# EAGLE design UVBox-I2C_LCD (EAGLE 8.6.0)
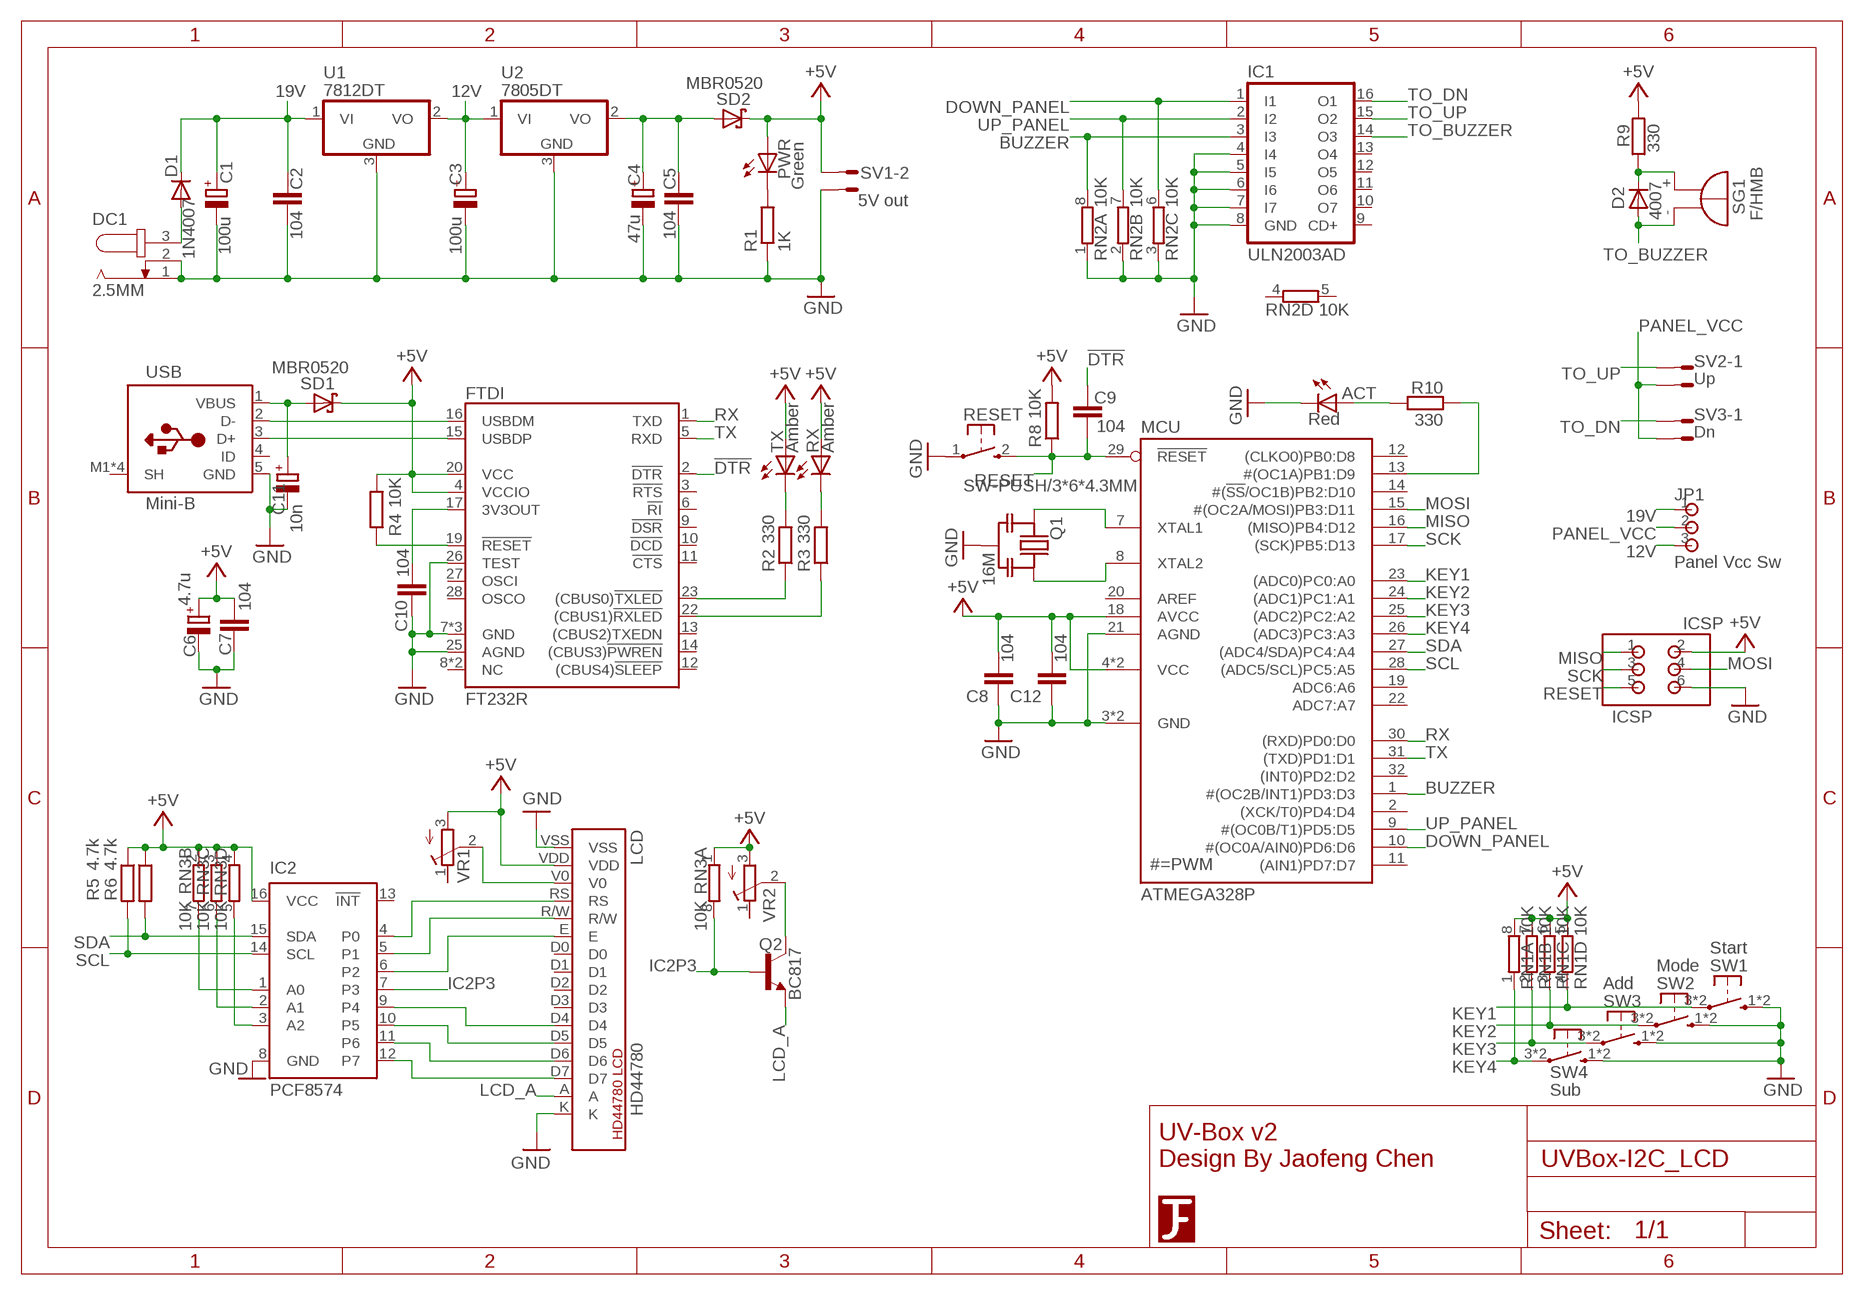
[diagram p0: schematic, sheet 1]

## Parts
ACT  Red  LEDCHIPLED_0805  [CHIPLED_0805]
C1  100u  CPOL-EU140CLH-0810  [140CLH-0810]
C2  104  C-EUC0805  [C0805]
C3  100u  CPOL-EUSMCC  [SMC_C]
C4  47u  CPOL-EUSMCC  [SMC_C]
C5  104  C-EUC0805  [C0805]
C6  4.7u  CPOL-EUSMCB  [SMC_B]
C7  104  C-EUC0603  [C0603]
C8  104  C-EUC0603  [C0603]
C9  104  C-EUC0603  [C0603]
C10  104  C-EUC0603  [C0603]
C11  10n  CPOL-EUSMCA  [SMC_A]
C12  104  C-EUC0603  [C0603]
D1  1N4007  DIODE-DO-214AC  [DO-214AC]
D2  4007  DIODE-DO214AA  [DO214AA]
DC1  2.5MM  DC-JACK/2.5MM  [SPC4078]
FTDI  FT232R  [SSOP28]
IC1  ULN2003AD  [SO16(R-PDSO-G16)]
IC2  PCF8574  PCF8574/SO16W  [SO16W]
ICSP  ICSP  PIN-2X3/2.54-DIP  [DIP-2.54-2X3]
JP1  Panel Vcc Sw  PIN-1X3-2.54  [DIP-2.54-1X3]
LCD  HD44780  LCD-HD44780-1602  [LCD_1602]
MCU  ATMEGA328P  ATMEGA328P-TQFP32  [TQFP32]
PWR  Green  LEDCHIPLED_0805  [CHIPLED_0805]
Q1  16M  CERMOSCILL-CSTCE  [CSTCE]
Q2  BC817  BC817-16SMD  [SOT23-BEC]
R1  1K  R-EU_R0603  [R0603]
R2  330  R-EU_R0603  [R0603]
R3  330  R-EU_R0603  [R0603]
R4  10K  R-EU_R0603  [R0603]
R5  4.7k  R-EU_R0603  [R0603]
R6  4.7k  R-EU_R0603  [R0603]
R8  10K  R-EU_R0603  [R0603]
R9  330  R-EU_R0603  [R0603]
R10  330  R-EU_R0603  [R0603]
RESET  SW-PUSH/3*6*4.3MM  [SW-3*6*4.3MM]
RN1  10K  RN4R-CAY16  [CAY16]
RN2  10K  RN4R-CAY16  [CAY16]
RN3  10K  RN4R-CAY16  [CAY16]
RX  Amber  LEDCHIPLED_0805  [CHIPLED_0805]
SD1  MBR0520  SCHOTTKY  [SOD123]
SD2  MBR0520  SCHOTTKY  [SOD123]
SG1  F/HMB  [F/HMB]
SV1  5V out  L02P  [L02P]
SV2  Up  L02P  [L02P]
SV3  Dn  L02P  [L02P]
SW1  Start  SW-PUSH/6*6*3.8MM  [SW-6*6*3.8MM]
SW2  Mode  SW-PUSH/6*6*3.8MM  [SW-6*6*3.8MM]
SW3  Add  SW-PUSH/6*6*3.8MM  [SW-6*6*3.8MM]
SW4  Sub  SW-PUSH/6*6*3.8MM  [SW-6*6*3.8MM]
TX  Amber  LEDCHIPLED_0805  [CHIPLED_0805]
U1  7812DT  [TO252]
U2  7805DT  [TO252]
U$2  LOGO-3B  [LOGO-3-B]
USB  Mini-B  USB-MINI-B/NO_HOLE  [USB-MINI-B(NO_HOLE)]
VR1  R-TRIMMT93XA  [RTRIMT93XA]
VR2  R-TRIMMT93XA  [RTRIMT93XA]

## Nets
12V: C3.+ JP1.3 U1.2(VO) U2.1(VI)
19V: C1.+ C2.1 D1.C JP1.1 U1.1(VI)
!DTR: C9.2 FTDI.2(!DTR)
!RESET: FTDI.19(!RESET) R4.1
!RXLED: FTDI.22((CBUS1)!RXLED) R3.1
!TXLED: FTDI.23((CBUS0)!TXLED) R2.1
+5V: C6.+ C7.1 C8.2 C12.2 FTDI.4(VCCIO) FTDI.20(VCC) IC2.16(VCC) ICSP.2 LCD.VDD MCU.4(VCC) MCU.6(VCC) MCU.18(AVCC) PWR.A R4.2 R5.1 R6.1 R8.2 R9.2 RN1.5 RN1.6 RN1.7 RN1.8 RN3.1 RN3.2 RN3.3 RN3.4 RX.A SD1.K SD2.K SV1.2 TX.A VR1.3(A) VR2.3(A)
A0: IC2.1(A0) RN3.7
A1: IC2.2(A1) RN3.6
A2: IC2.3(A2) RN3.5
ACT_LED: ACT.A R10.2
BUZZER: IC1.3(I3) MCU.1(#(OC2B/INT1)PD3:D3) RN2.8
D+: FTDI.15(USBDP) USB.3(D+)
D-: FTDI.16(USBDM) USB.2(D-)
DOWN_PANEL: IC1.1(I1) MCU.10(#(OC0A/AIN0)PD6:D6) RN2.6
E: IC2.6(P2) LCD.E
GND: ACT.C C1.- C2.2 C3.- C4.- C5.2 C6.- C7.2 C8.1 C10.1 C11.- C12.1 DC1.1 DC1.2 FTDI.7(GND) FTDI.18(GND) FTDI.21(GND) FTDI.25(AGND) FTDI.26(TEST) IC1.4(I4) IC1.5(I5) IC1.6(I6) IC1.7(I7) IC1.8(GND) IC2.8(GND) ICSP.6 LCD.K LCD.VSS MCU.3(GND) MCU.5(GND) MCU.21(AGND) Q1.2(GND) R1.1 RESET.1(P) RN2.1 RN2.2 RN2.3 SV1.1 SW1.1(S) SW1.2(S) SW2.1(S) SW2.2(S) SW3.1(S) SW3.2(S) SW4.1(S) SW4.2(S) U1.3(GND) U2.3(GND) USB.5(GND)
IC2P3: IC2.7(P3) Q2.B RN3.8
KEY1: MCU.23((ADC0)PC0:A0) RN1.4 SW1.3(P) SW1.4(P)
KEY2: MCU.24((ADC1)PC1:A1) RN1.3 SW2.3(P) SW2.4(P)
KEY3: MCU.25((ADC2)PC2:A2) RN1.2 SW3.3(P) SW3.4(P)
KEY4: MCU.26((ADC3)PC3:A3) RN1.1 SW4.3(P) SW4.4(P)
LCD_A: LCD.A Q2.E
MISO: ICSP.1 MCU.16((MISO)PB4:D12)
MOSI: ICSP.4 MCU.15(#(OC2A/MOSI)PB3:D11)
N$2: C11.+ SD1.A USB.1(VBUS)
N$3: C4.+ C5.1 SD2.A U2.2(VO)
N$4: D1.A DC1.3
N$10: PWR.C R1.2
N$12: Q2.C VR2.2(S)
N$16: R2.2 TX.C
N$17: R3.2 RX.C
N$18: D2.C R9.1 SG1.+
N$25: IC2.12(P7) LCD.D7
N$26: IC2.11(P6) LCD.D6
N$27: IC2.10(P5) LCD.D5
N$28: IC2.9(P4) LCD.D4
N$31: C10.2 FTDI.17(3V3OUT)
PANEL_VCC: JP1.2 SV2.2 SV3.2
PB1: MCU.13(#(OC1A)PB1:D9) R10.1
R/W: IC2.5(P1) LCD.R/W
RESET: C9.1 ICSP.5 MCU.29(!RESET) R8.1 RESET.2(S)
RS: IC2.4(P0) LCD.RS
RX: FTDI.1(TXD) MCU.30((RXD)PD0:D0)
SCK: ICSP.3 MCU.17((SCK)PB5:D13)
SCL: IC2.14(SCL) MCU.28((ADC5/SCL)PC5:A5) R5.2
SDA: IC2.15(SDA) MCU.27((ADC4/SDA)PC4:A4) R6.2
TO_BUZZER: D2.A IC1.14(O3) SG1.-
TO_DN: IC1.16(O1) SV3.1
TO_UP: IC1.15(O2) SV2.1
TX: FTDI.5(RXD) MCU.31((TXD)PD1:D1)
UP_PANEL: IC1.2(I2) MCU.9(#(OC0B/T1)PD5:D5) RN2.7
VD: LCD.V0 VR1.2(S)
XTAL1: MCU.7(XTAL1) Q1.1(IN)
XTAL2: MCU.8(XTAL2) Q1.3(OUT)
Unconnected: FTDI.3(!RTS) FTDI.6(!RI) FTDI.8(NC) FTDI.9(!DSR) FTDI.10(!DCD) FTDI.11(!CTS) FTDI.12((CBUS4)!SLEEP) FTDI.13((CBUS2)TXEDN) FTDI.14((CBUS3)!PWREN) FTDI.24(NC) FTDI.27(OSCI) FTDI.28(OSCO) IC1.9(CD+) IC1.10(O7) IC1.11(O6) IC1.12(O5) IC1.13(O4) IC2.13(!INT) LCD.D0 LCD.D1 LCD.D2 LCD.D3 LCD.P$1 LCD.P$2 LCD.P$3 LCD.P$4 MCU.2((XCK/T0)PD4:D4) MCU.11((AIN1)PD7:D7) MCU.12((CLKO0)PB0:D8) MCU.14(#(!SS!/OC1B)PB2:D10) MCU.19(ADC6:A6) MCU.20(AREF) MCU.22(ADC7:A7) MCU.32((INT0)PD2:D2) RN2.4 RN2.5 USB.4(ID) USB.M1(SH) USB.M2(SH) USB.M3(SH) USB.M4(SH) VR1.1(E) VR2.1(E)

## Notes on the sheet
- UV-Box v2
  Design By Jaofeng Chen

## Library data of the parts
ACT PWR RX TX = led:LED: LED OSRAM: - CHIPLED LG R971, LG N971, LY N971, LG Q971, LY Q971, LO R971, LY R971 LH N974, LH R974 LS Q976, LO Q976, LY Q976 LO Q996 - Hyper CHIPLED LW Q18S LB Q993, LB Q99A, LB R99A - SideLED LS A670, LO A670, LY A670, LG A670, LP A670 LB A673, LV A673, LT A673, LW A673 LH A674 LY A675 LS A676, LA A676, LO A676, LY A676, LW A676 LS A679, LY A679, LG A679 - Hyper Micro SIDELED® LS Y876, LA Y876, LO Y876, LY Y876 LT Y87S - SmartLED LW L88C, LW L88S LB L89C, LB L89S, LG L890 LS L89K, LO L89K, LY L89K LS L896, LA L896, LO L896, LY L896 - TOPLED LS T670, LO T670, LY T670, LG T670, LP T670 LSG T670, LSP T670, LSY T670, LOP T670, LYG T670 LG T671, LOG T671, LSG T671 LB T673, LV T673, LT T673, LW T673 LH T674 LS T676, LA T676, LO T676, LY T676, LB T676, LH T676, LSB T676, LW T676 LB T67C, LV T67C, LT T67C, LS T67K, LO T67K, LY T67K, LW E67C LS E67B, LA E67B, LO E67B, LY E67B, LB E67C, LV E67C, LT E67C LW T67C LS T679, LY T679, LG T679 LS T770, LO T770, LY T770, LG T770, LP T770 LB T773, LV T773, LT T773, LW T773 LH T774 LS E675, LA E675, LY E675, LS T675 LS T776, LA T776, LO T776, LY T776, LB T776 LHGB T686 LT T68C, LB T68C - Hyper Mini TOPLED® LB M676 - Mini TOPLED Santana® LG M470 LS M47K, LO M47K, LY M47K Source: http://www.osram.convergy.de LUXEON: - LUMILED® LXK2-PW12-R00, LXK2-PW12-S00, LXK2-PW14-U00, LXK2-PW14-V00 LXK2-PM12-R00, LXK2-PM12-S00, LXK2-PM14-U00 LXK2-PE12-Q00, LXK2-PE12-R00, LXK2-PE12-S00, LXK2-PE14-T00, LXK2-PE14-U00 LXK2-PB12-K00, LXK2-PB12-L00, LXK2-PB12-M00, LXK2-PB14-N00, LXK2-PB14-P00, LXK2-PB14-Q00 LXK2-PR12-L00, LXK2-PR12-M00, LXK2-PR14-Q00, LXK2-PR14-R00 LXK2-PD12-Q00, LXK2-PD12-R00, LXK2-PD12-S00 LXK2-PH12-R00, LXK2-PH12-S00 LXK2-PL12-P00, LXK2-PL12-Q00, LXK2-PL12-R00 Source: www.luxeon.com KINGBRIGHT: KA-3528ASYC Source: www.kingbright.com
C1 C3 C4 C6 C11 = rcl:CPOL-EU: POLARIZED CAPACITOR, European symbol
C2 C5 C7-C10 C12 = rcl:C-EU: CAPACITOR, European symbol
D1 D2 = diode:DIODE-: DIODE
DC1 = 0_MyCustom:DC-JACK: DC 電源插座 Power Jack, DC, Right Angle, Through Hole, Rated 5A at 16VDC, PC Terminals Distributor: Farnell (www.Farnell.de) Drawing: 84N1161.pdf / 84N1162.pdf Manufacturer: SPC Technology (www.spctechnology.com) Type: SPC4077(2mm) / SPC 4078(2.5mm)
FTDI = 0_MyIC:FT232R: FTDI FT232R
IC1 = 0_MyIC:ULN2003A
IC2 = 0_MyIC:PCF8574: 8-bit I2C I/O expander with interrupt Remote 8-Bit I2C-Bus I/O Expander for with Interrupt output http://www.ti.com/product/PCF8574/description Description This 8-bit input/output (I/O) expander for the two-line bidirectional bus (I2C) is designed for 2.5-V to 6-V VCC operation. The PCF8574 device provides general-purpose remote I/O expansion for most microcontroller families by way of the I2C interface [serial clock (SCL), serial data (SDA)]. The device features an 8-bit quasi-bidirectional I/O port (P0–P7), including latched outputs with high-current drive capability for directly driving LEDs. Each quasi-bidirectional I/O can be used as an input or output without the use of a data-direction control signal. At power on, the I/Os are high. In this mode, only a current source to VCC is active. Features • Low Standby-Current Consumption of 10 µA Max • I2C to Parallel-Port Expander • Open-Drain Interrupt Output • Compatible With Most Microcontrollers • Latched Outputs With High-Current Drive Capability for Directly Driving LEDs • Latch-Up Performance Exceeds 100 mA Per JESD 78, Class II
ICSP = 0_MyCustom:PIN-2X3
JP1 = 0_MyCustom:PIN-1X3; PIN1: 19v; PIN3: 12v
LCD = 0_MyCustom:LCD-HD44780: Hitachi HD44780U 1602 LCD 相容板
MCU = 0_MyIC:ATMEGA*-TQFP32: Atmel® AVR® 8-bit Microcontroller with 4/8/16/32KBytes In- System Programmable Flash Device Flash EEPROM RAM Max Speed Power ATmega8 8KBytes 512Bytes 1KBytes 0~16MHz 4.5V~5.5V ATmega8A 8KBytes 512Bytes 1KBytes 0~16MHz 2.7V~5.5V ATmega8L 8KBytes 512Bytes 1KBytes 0~8MHz 2.7V~5.5V ATmega48A 4KBytes 256Bytes 512Bytes 0~20MHz 1.8V~5.5V ATmega48PA 4KBytes 256Bytes 512Bytes 0~20MHz 1.8V~5.5V ATmega88A 8KBytes 512Bytes 1KBytes 0~20MHz 1.8V~5.5V ATmega88PA 8KBytes 512Bytes 1KBytes 0~20MHz 1.8V~5.5V ATmega168A 16KBytes 512Bytes 1KBytes 0~20MHz 1.8V~5.5V ATmega168PA 16KBytes 512Bytes 1KBytes 0~20MHz 1.8V~5.5V ATmega328 32KBytes 1KBytes 2KBytes 0~20MHz 1.8V~5.5V ATmega328P 32KBytes 1KBytes 2KBytes 0~20MHz 1.8V~5.5V
Q1 = 0_MyCustom:CERMOSCILL
Q2 = transistor-npn:BC817*: NPN Transistor
R1-R6 R8-R10 = rcl:R-EU_: RESISTOR, European symbol
RESET SW1-SW4 = 0_MyCustom:SW-PUSH: 無段式開關
RN1-RN3 = 0_MyCustom:RN4R: B型排阻 8P4R
SD1 SD2 = 0_MyCustom:SCHOTTKY
SG1 = buzzer:F/HMB: BUZZER Source: Buerklin; OC_FARNELL: unknown; OC_NEWARK: unknown
SV1-SV3 = con-amp-mt:L02P: AMP MT CONNECTOR; OC_FARNELL: unknown; OC_NEWARK: unknown
U1 U2 = linear:78*: Positive VOLTAGE REGULATOR Source: http://cache.national.com/ds/LM/LM78L05.pdf http://www.fairchildsemi.com/ds/LM/LM7805.pdf
U$2 = 0_MyCustom:LOGO-3
USB = 0_MyCustom:USB-MINI-B
VR1 VR2 = rcl:R-TRIMM: Trimm resistor

## Net classes
0 default: clearance 0.205 mm

## Board
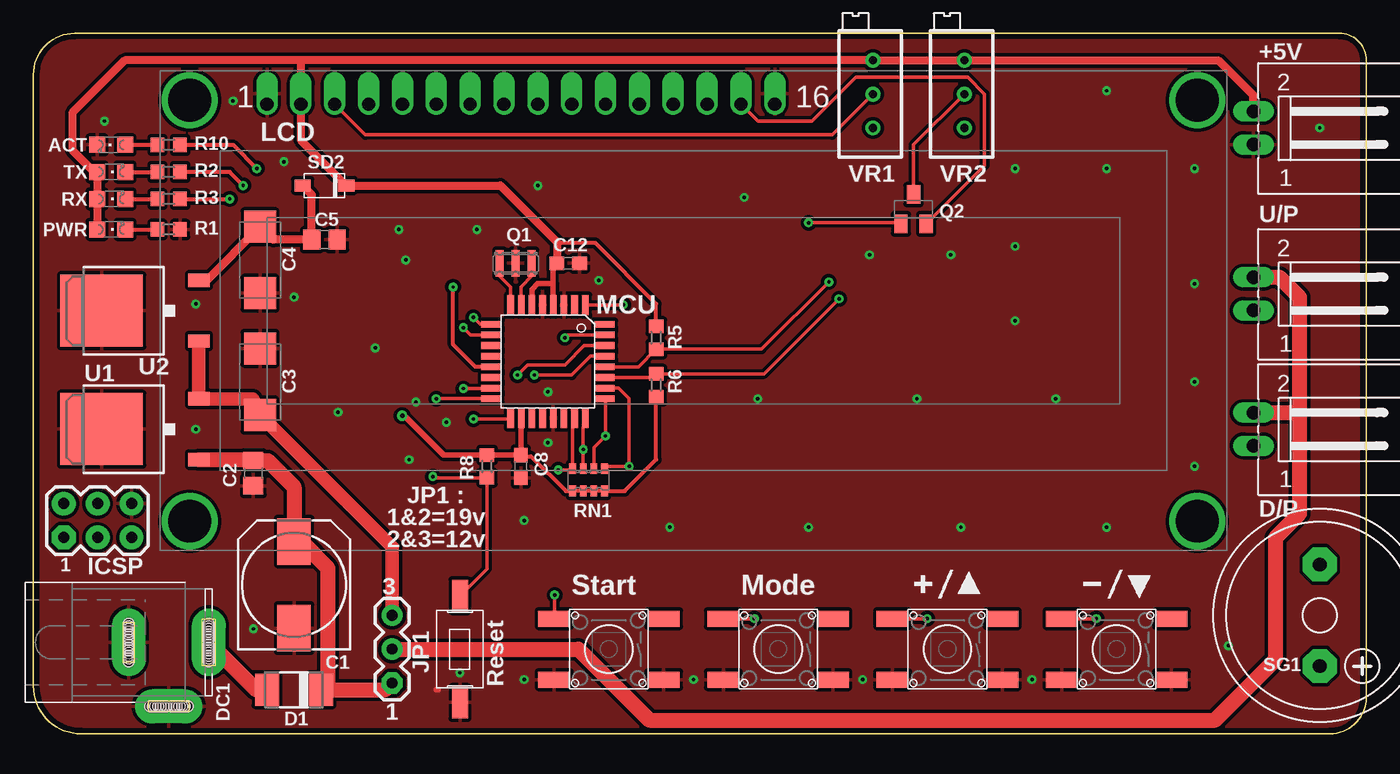
[diagram p1: board, top side]
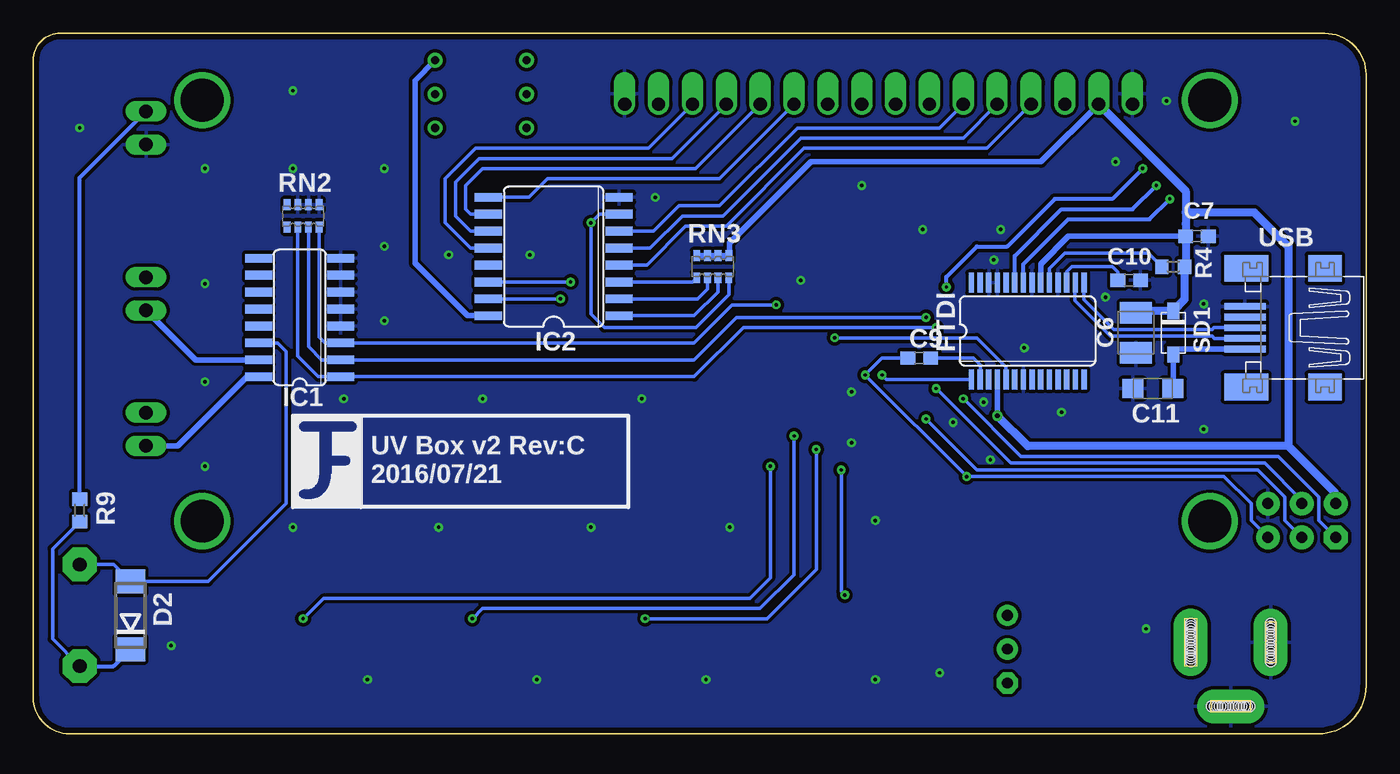
[diagram p2: board, bottom side, seen from below]

Size 100 x 52.57 mm. Coordinates in mm from the lower left corner, seen from the top.
Outline: 0,49.47 0,3.59 arc90 3.59,0 97.29,0 arc90 100,2.71 100,50.57 arc90 98,52.57 3.1,52.57 arc90 0,49.47
Copper layers (1*16): Top 0.035mm / dielectric 1.5mm / Bottom 0.035mm
Design rules "default *": minimum track width 10mil, minimum drill 10mil, track to track 8mil, track to pad 8mil, pad to pad 8mil, via to via 8mil, smd to smd 8mil, copper to edge 15mil, drill to drill 8mil, minimum pad ring 10mil, minimum via ring 8mil, stop-mask expansion 4mil, vias tented up to drill 0mil, thermal gap 10mil

### Footprints (pad centres in the part's own frame; a part is rotated, then mirrored left to right if it is on the bottom)
CHIPLED_0805 = smd 1.2 x 1.2: A 0,-1.05; C 0,1.05
140CLH-0810 = smd 3.5 x 2.5: + 3.25,0; - -3.25,0
C0805 = smd 1.3 x 1.5: 1 -0.95,0; 2 0.95,0
SMC_C = smd 2.4 x 2.4: + -2.5,0; - 2.5,0
SMC_B = smd 1.6 x 2.4: + -1.5,0; - 1.5,0
C0603 = smd 1.1 x 1: 1 -0.85,0; 2 0.85,0
SMC_A = smd 1.6 x 1.4: + -1.5,0; - 1.5,0
DO-214AC = smd 1.8 x 2.4: A 2.025,0; C -2.025,0
DO214AA = smd 1.8 x 2.2: A 2.55,0; C -2.55,0
SPC4078 = drill 0.813 pad 2.54 long: 1 -3,0; 2 0,-4.8; 3 3,0 | hole 0.813: -3,1.4; -3,1.2; -3,1; -3,0.8; -3,0.6; -3,0.4; -3,0.2; -3,-1.4; -3,-1.2; -3,-1; -3,-0.8; -3,-0.6; -3,-0.4; -3,-0.2; 3,1.4; 3,1.2; 3,1; 3,0.8; 3,0.6; 3,0.4; 3,0.2; 3,-1.4; 3,-1.2; 3,-1; 3,-0.8; 3,-0.6; 3,-0.4; 3,-0.2; -1.4,-4.8; -1.2,-4.8; -1,-4.8; -0.8,-4.8; -0.6,-4.8; -0.4,-4.8; -0.2,-4.8; 1.4,-4.8; 1.2,-4.8; 1,-4.8; 0.8,-4.8; 0.6,-4.8; 0.4,-4.8; 0.2,-4.8
SSOP28 = smd 0.4 x 1.5: 1 -4.225,-3.625; 2 -3.575,-3.625; 3 -2.925,-3.625; 4 -2.275,-3.625; 5 -1.625,-3.625; 6 -0.975,-3.625; 7 -0.325,-3.625; 8 0.325,-3.625; 9 0.975,-3.625; 10 1.625,-3.625; 11 2.275,-3.625; 12 2.925,-3.625; 13 3.575,-3.625; 14 4.225,-3.625; 15 4.225,3.625; 16 3.575,3.625; 17 2.925,3.625; 18 2.275,3.625; 19 1.625,3.625; 20 0.975,3.625; 21 0.325,3.625; 22 -0.325,3.625; 23 -0.975,3.625; 24 -1.625,3.625; 25 -2.275,3.625; 26 -2.925,3.625; 27 -3.575,3.625; 28 -4.225,3.625
SO16(R-PDSO-G16) = smd 0.66 x 2.032: 1 -4.445,-3.073; 2 -3.175,-3.073; 3 -1.905,-3.073; 4 -0.635,-3.073; 5 0.635,-3.073; 6 1.905,-3.073; 7 3.175,-3.073; 8 4.445,-3.073; 9 4.445,3.073; 10 3.175,3.073; 11 1.905,3.073; 12 0.635,3.073; 13 -0.635,3.073; 14 -1.905,3.073; 15 -3.175,3.073; 16 -4.445,3.073
SO16W = smd 0.66 x 2.032: 1 -4.445,-4.902; 2 -3.175,-4.902; 3 -1.905,-4.902; 4 -0.635,-4.902; 5 0.635,-4.902; 6 1.905,-4.902; 7 3.175,-4.902; 8 4.445,-4.902; 9 4.445,4.902; 10 3.175,4.902; 11 1.905,4.902; 12 0.635,4.902; 13 -0.635,4.902; 14 -1.905,4.902; 15 -3.175,4.902; 16 -4.445,4.902
DIP-2.54-2X3 = drill 0.82 pad 1.778 octagon: 1 -1.27,2.54 | drill 0.82 pad 1.778: 2 1.27,2.54; 3 -1.27,0; 4 1.27,0; 5 -1.27,-2.54; 6 1.27,-2.54
DIP-2.54-1X3 = drill 0.8 pad 1.6 octagon: 1 -2.54,0 | drill 0.8 pad 1.6: 2 0,0; 3 2.54,0
LCD_1602 = drill 1 pad 1.6 offset: A 3.56,15.5; D0 -16.76,15.5; D1 -14.22,15.5; D2 -11.68,15.5; D3 -9.14,15.5; D4 -6.6,15.5; D5 -4.06,15.5; D6 -1.52,15.5; D7 1.02,15.5; E -19.3,15.5; K 6.1,15.5; R/W -21.84,15.5; RS -24.38,15.5; V0 -26.92,15.5; VDD -29.46,15.5; VSS -32,15.5 | drill 3.2 pad 3.8: P$1 -37.8,-15.8; P$2 37.8,-15.8; P$3 37.8,15.8; P$4 -37.8,15.8
TQFP32 = smd 1.5 x 0.5: 1 -4.25,2.8; 2 -4.25,2; 3 -4.25,1.2; 4 -4.25,0.4; 5 -4.25,-0.4; 6 -4.25,-1.2; 7 -4.25,-2; 8 -4.25,-2.8; 17 4.25,-2.8; 18 4.25,-2; 19 4.25,-1.2; 20 4.25,-0.4; 21 4.25,0.4; 22 4.25,1.2; 23 4.25,2; 24 4.25,2.8 | smd 0.5 x 1.5: 9 -2.8,-4.25; 10 -2,-4.25; 11 -1.2,-4.25; 12 -0.4,-4.25; 13 0.4,-4.25; 14 1.2,-4.25; 15 2,-4.25; 16 2.8,-4.25; 25 2.8,4.25; 26 2,4.25; 27 1.2,4.25; 28 0.4,4.25; 29 -0.4,4.25; 30 -1.2,4.25; 31 -2,4.25; 32 -2.8,4.25
CSTCE = smd 0.6 x 2: 1 -1.2,0; 2 0,0; 3 1.2,0
SOT23-BEC = smd 1 x 1.4: B -0.95,-1.1; C 0,1.1; E 0.95,-1.1
R0603 = smd 1 x 1.1: 1 -0.85,0; 2 0.85,0
SW-3*6*4.3MM = smd 2.4 x 1.2: 1 -4,0; 2 4,0
CAY16 = smd 0.508 x 0.813: 1 -1.2,-0.838; 2 -0.4,-0.838; 3 0.4,-0.838; 4 1.2,-0.838; 5 1.2,0.838; 6 0.4,0.838; 7 -0.4,0.838; 8 -1.2,0.838
SOD123 = smd 1.219 x 0.914: A -1.638,0; K 1.638,0
F/HMB = drill 1.016 pad 2.54 octagon: + 3.81,0; - -3.81,0
L02P = drill 1.016 long: 1 1.25,-6.25; 2 -1.25,-6.25
SW-6*6*3.8MM = smd 2.4 x 1.2: 1 -4.109,2.286; 2 4.109,2.286; 3 -4.109,-2.286; 4 4.109,-2.286
TO252 = smd 1 x 1.6: 1 -2.28,-4.8; 2 2.28,-4.8 | smd 5.4 x 6.2: 3 0,2.5
USB-MINI-B(NO_HOLE) = smd 3.1 x 0.5: 1 3,1.6; 2 3,0.8; 3 3,0; 4 3,-0.8; 5 3,-1.6 | smd 2.5 x 2: M1 -3,-4.45; M2 -3,4.45 | smd 3.3 x 2: M3 2.9,4.45; M4 2.9,-4.45
RTRIMT93XA = drill 0.61: 1 0,-2.54; 2 0,0; 3 0,2.54

### Placement (x,y rotation side)
ACT  5.84,44.2 90 top
C1  19.56,11.18 90 top
C2  16.51,19.56 270 top
C3  17.02,26.42 90 top
C4  17.02,35.56 270 top
C5  21.84,37.08 0 top
C6  17.27,30.1 270 bottom
C7  12.7,37.34 0 bottom
C8  36.58,20.07 90 top
C9  33.53,28.19 0 bottom
C10  17.78,34.04 180 bottom
C11  16,25.91 180 bottom
C12  40.13,35.31 180 top
D1  19.56,3.3 180 top
D2  92.71,8.89 90 bottom
DC1  10.16,6.86 0 top
FTDI  25.4,30.23 0 bottom
IC1  80.01,31.24 90 bottom
IC2  60.96,35.81 90 bottom
ICSP  4.83,16 90 top
JP1  26.92,6.35 90 top
LCD  49.53,31.75 0 top
MCU  38.61,27.94 270 top
PWR  5.84,37.85 270 top
Q1  36.2,35.31 180 top
Q2  66.04,39.37 0 top
R1  10.16,37.85 180 top
R2  10.16,42.16 180 top
R3  10.16,40.13 180 top
R4  14.48,35.05 0 bottom
R5  46.74,29.72 270 top
R6  46.74,26.16 90 top
R8  34.04,20.07 90 top
R9  96.52,16.76 90 bottom
R10  10.16,44.2 180 top
RESET  32,6.35 90 top
RN1  41.66,19.05 180 top
RN2  79.76,38.86 180 bottom
RN3  49.02,35.05 180 bottom
RX  5.84,40.13 270 top
SD1  14.48,30.1 90 bottom
SD2  21.84,41.15 0 top
SG1  96.52,8.89 270 top
SV1  97.79,45.47 270 top
SV2  97.79,33.02 270 top
SV3  97.79,22.86 270 top
SW1  43.18,6.35 180 top
SW2  55.88,6.35 180 top
SW3  68.58,6.35 180 top
SW4  81.28,6.35 180 top
TX  5.84,42.16 270 top
U1  7.62,22.86 90 top
U2  7.62,31.75 90 top
U$1  [TEXT_UP]  68.58,11.18 0 top
U$2  77.98,20.32 0 top
U$3  [TEXT_DN]  81.28,11.18 0 top
USB  6.1,30.48 180 bottom
VR1  62.99,48.01 0 top
VR2  69.85,48.01 0 top

### Tracks (layer width: path | path; a pad name or v marks a point on that pad's centre or on a via)
12V
  Top 1.016: U2.1 U1.2 16.46,25.14 C3.+ 26.92,14.01 JP1.3
19V
  Top 1.143: U1.1 16.44,20.58 C2.1 17.59,20.51 19.56,18.54 C1.+ 20.12,14.43 22.1,12.45 22.1,3.3 | D1.C 22.1,3.3 | 22.1,3.3 26.42,3.3 JP1.1
!DTR
  Bottom 0.254: FTDI.2 28.96,26.62 28.96,27.69 29.46,28.19 C9.2
!RESET
  Bottom 0.254: FTDI.19 23.77,34.9 22.61,36.07 16.34,36.07 R4.1
!RXLED  (via drill 0.25)
  Top 0.305: R3.1 v14.73,40.13
  Bottom 0.305: FTDI.22 25.73,35.23 22.35,38.61 16.26,38.61 v14.73,40.13
!TXLED  (via drill 0.25)
  Top 0.305: v15.75,41.15 14.73,42.16 R2.1
  Bottom 0.305: FTDI.23 26.38,35.85 22.86,39.37 17.53,39.37 v15.75,41.15
+5V  (via drill 0.35)
  Top 0.305: R5.1 46.74,32.26 42.16,36.83 39.37,36.83 39.28,36.92 | R6.1 46.74,20.57 44.37,18.21 RN1.8 RN1.7 RN1.6 RN1.5 39.95,18.21 37.34,20.83 36.66,20.83 C8.2
  Top 0.406: MCU.18 36.58,23.66 C8.2 R8.2 30.78,20.92 27.82,23.88 27.69,23.88 v27.68,23.86 | 39.01,33.78 MCU.4 | 39.01,33.78 39.01,35.03 C12.2 38.97,35.62 | MCU.6 37.41,33.34 37.85,33.78 39.01,33.78
  Top 0.61: 20.07,50.55 6.86,50.55 2.92,46.61 2.92,43.78 4.79,41.91 | 20.07,50.55 LCD.VDD 20.07,44.56 SD2.K 35.05,41.15 39.28,36.92 C12.2 | SV1.2 91.54,47.91 88.9,50.55 VR2.3 VR1.3 20.07,50.55 | TX.A 4.79,41.91 | 4.79,41.91 RX.A PWR.A
  Bottom 0.305: RN3.1 47.75,35.81 | SV1.2 96.52,41.74 R9.2
  Bottom 0.406: C7.1 22.35,37.34 24.43,35.27 FTDI.20 | 13.55,35.13 R4.2 | 17.13,31.74 C6.+ | v27.68,23.86 FTDI.4 27.68,24.39 | RN3.4 RN3.3 RN3.2 RN3.1 | IC2.16 67.44,31.37 71.37,35.31 71.37,49.02 VR2.3 | 47.75,35.81 47.75,36.83 41.66,42.93 24.39,42.93 LCD.VDD
  Bottom 0.61: C7.1 13.55,35.13 | R4.2 13.63,32.59 SD1.K 17.13,31.74 | v27.68,23.86 25.4,21.59 5.84,21.59 | 13.55,38.27 C7.1 | ICSP.2 2.29,18.03 5.84,21.59 | 5.84,21.59 5.84,36.58 8.38,39.12 13.55,39.12 | 13.55,39.12 13.55,40.73 LCD.VDD | 13.55,39.12 C7.1
A0
  Bottom 0.254: IC2.1 50.42,31.37 48.62,33.17 RN3.7
A1
  Bottom 0.254: IC2.2 50.16,32.64 49.42,33.38 RN3.6
A2
  Bottom 0.254: IC2.3 50.53,33.91 RN3.5
ACT_LED
  Top 0.305: ACT.A R10.2
BUZZER  (via drill 0.25)
  Top 0.254: MCU.1 v44.26,32.19
  Bottom 0.254: RN2.8 78.56,29.79 78.11,29.34 IC1.3 50.42,29.34 47.57,32.19 v44.26,32.19
D+
  Bottom 0.254: FTDI.15 21.18,32.6 18.92,30.35 11.56,30.35 11.43,30.48 USB.3
D-
  Bottom 0.254: USB.2 11.39,29.68 11.56,29.84 19.18,29.84 21.84,32.51 21.84,33.83 FTDI.16
DOWN_PANEL  (via drill 0.25)
  Top 0.254: MCU.10 32.8,29.94 v32.26,30.48
  Bottom 0.254: v32.26,30.48 46.74,30.48 50.42,26.8 IC1.1 78.61,26.8 80.16,28.34 RN2.6
E
  Bottom 0.254: LCD.E 32,45.47 42.67,45.47 48.51,39.62 51.56,39.62 53.47,37.72 IC2.6
GND  (via drill 0.25)
  Top 0.406: 30.35,3.3 30.23,3.3
  Bottom 0.254: 23.11,33.86 FTDI.18
  Bottom 0.305: FTDI.25 27.69,33.85 | FTDI.21 25.15,33.85 | 76.96,35.71 IC1.8
  Bottom 0.406: 17.5,28.37 C6.- | 11.94,37.25 C7.2 | 91.27,44.2 SV1.1
  other vias: 14.99,47.5 22.86,24.13 38.61,25.65 53.34,40.26 38.61,21.84 47.75,15.49 68.83,35.94 62.74,35.94 18.8,42.93 54.36,25.15 58.17,15.49 87.12,20.07 80.52,15.49 69.6,15.49 80.52,42.42 87.12,26.42 87.12,42.42 87.12,33.78 73.66,36.58 27.43,37.85 37.85,41.15 25.65,28.96 89.66,6.6 96.52,45.47 66.29,25.15 76.71,25.15 19.56,32.77 42.42,34.04 33.27,37.85 12.19,22.86 12.19,32.26 27.94,35.56 5.33,45.97 32,4.57 36.83,4.06 49.53,4.06 62.23,4.06 74.93,4.06 73.66,30.99 73.66,42.42 80.52,48.26 16.51,7.87 36.83,16 30.99,23.37 28.19,20.57 28.7,24.89
  pour Top (isolate 0.254): 3.1,52.58 98.03,52.58 arc-90 100.08,50.53 100.08,2.74 arc-90 97.34,0 3.59,0 arc-90 0,3.59 0,49.48 arc-90
  pour Bottom (isolate 0.254): 3.1,52.58 98.03,52.58 arc-90 100.08,50.53 100.08,2.74 arc-90 97.34,0 3.59,0 arc-90 0,3.59 0,49.48 arc-90
IC2P3  (via drill 0.25 pad 0.61)
  Top 0.254: Q2.B 65.01,38.35 v58.17,38.35
  Bottom 0.254: RN3.8 47.82,32.95 50.29,30.48 57.15,30.48 58.17,31.5 v58.17,38.35 57.53,38.99 IC2.7
KEY1  (via drill 0.25)
  Top 0.254: MCU.23 40.64,23.66 40.64,23.11 40.46,22.93 RN1.4 40.38,19.81 39.62,19.81 v39.38,19.8 | v39.12,10.41 39.12,8.68 SW1.4
  Bottom 0.254: v39.38,19.8 39.38,10.68 v39.12,10.41
KEY2  (via drill 0.25)
  Top 0.254: MCU.24 41.4,23.11 41.26,22.97 v41.26,21.34 RN1.3 | SW2.4 v54.1,8.64
  Bottom 0.254: v54.1,8.64 44.96,8.64 41.26,12.34 v41.26,21.34
KEY3  (via drill 0.25)
  Top 0.254: RN1.2 42.06,21.48 v42.93,22.35 42.93,25.07 MCU.25 | 64.01,8.64 SW3.4 v67.06,8.64
  Bottom 0.254: v67.06,8.64 66.29,9.4 45.47,9.4 42.93,11.94 v42.93,22.35
KEY4  (via drill 0.25)
  Top 0.254: MCU.26 43.91,25.94 44.7,25.15 v44.7,20.07 43.03,20.07 RN1.1 | v79.76,8.64 SW4.4
  Bottom 0.254: v44.7,20.07 44.7,11.68 46.23,10.16 78.23,10.16 v79.76,8.64
LCD_A
  Top 0.254: LCD.A 54.37,45.97 58.42,45.97 61.72,49.28 70.1,49.28 71.37,48.01 71.37,42.65 Q2.E
MISO  (via drill 0.25)
  Top 0.254: v30.23,25.15 MCU.16
  Bottom 0.254: ICSP.1 3.56,16 3.56,17.78 6.6,20.83 25.91,20.83 v30.23,25.15
MOSI  (via drill 0.25)
  Top 0.254: v32.26,25.91 34.33,25.91 MCU.15
  Bottom 0.254: ICSP.4 4.83,17.53 7.62,20.32 26.67,20.32 v32.26,25.91
N$2
  Bottom 0.406: USB.1 14.19,28.88 SD1.A 14.48,25.93 C11.+
N$3
  Top 0.61: SD2.A 20.89,40.46 C5.1 17.99,37.08 C4.+ 12.99,34.03 U2.2
  Top 1.016: 12.45,34.06 U2.2
N$4
  Top 1.143: DC1.3 16.72,3.3 D1.A
N$10
  Top 0.305: PWR.C R1.2
N$12
  Top 0.254: VR2.2 66.04,44.2 Q2.C
N$16
  Top 0.305: TX.C R2.2
N$17
  Top 0.305: RX.C R3.2
N$18
  Bottom 0.254: R9.1 98.55,13.88 98.55,7.11 SG1.+
  Bottom 0.305: D2.C 93.97,5.08 SG1.+
N$25
  Bottom 0.254: IC2.12 67.18,36.45 69.09,38.35 69.09,41.66 66.8,43.94 53.86,43.94 LCD.D7
N$26
  Bottom 0.254: LCD.D6 52.07,43.18 66.55,43.18 68.33,41.4 68.33,38.86 67.18,37.72 IC2.11
N$27
  Bottom 0.254: IC2.10 67.18,38.99 67.56,39.37 67.56,41.15 66.29,42.42 50.3,42.42 LCD.D5
N$28
  Bottom 0.254: LCD.D4 48.51,41.66 61.42,41.66 62.81,40.26 IC2.9
N$31
  Bottom 0.254: C10.2 18.63,34.63 19.05,35.05 22.1,35.05 22.48,34.67 FTDI.17
PANEL_VCC
  Top 1.143: SV2.2 93.49,34.27 95,32.77 95,24.13 | 95,24.13 95,16.51 93.22,14.73 93.22,5.59 88.65,1.02 46.23,1.02 40.89,6.35 JP1.2 | 95,24.13 92.58,24.13 92.56,24.11 SV3.2
PB1  (via drill 0.25)
  Top 0.305: MCU.13 33.17,27.54 31.5,29.21 v31.5,33.53 | R10.1 14.99,44.2 v16.76,42.42
  Bottom 0.305: v31.5,33.53 31.5,34.29 29.21,36.58 26.92,36.58 23.37,40.13 19.05,40.13 v16.76,42.42
R/W
  Bottom 0.254: LCD.R/W 30.23,44.7 42.42,44.7 48.26,38.86 51.31,38.86 53.72,36.45 IC2.5
RESET  (via drill 0.25)
  Top 0.254: v37.59,26.92 40.39,26.92 41.8,28.34 MCU.29 | v29.97,19.3 30.06,19.22 R8.1 34.04,12.38 RESET.2
  Bottom 0.254: C9.1 36.32,28.19 v37.59,26.92 v29.97,19.3 10.67,19.3 8.64,17.27 8.64,16 ICSP.5
RS
  Bottom 0.254: IC2.4 53.98,35.18 51.05,38.1 48.01,38.1 42.16,43.94 28.46,43.94 LCD.RS
RX  (via drill 0.25)
  Top 0.254: v36.32,26.92 37.08,27.69 39.88,27.69 41.33,29.14 MCU.30
  Bottom 0.254: v36.32,26.92 36,26.6 FTDI.1
SCK  (via drill 0.25)
  Top 0.254: MCU.17 35.74,23.62 v33.02,23.62
  Bottom 0.254: ICSP.3 6.1,16 6.1,17.78 8.13,19.81 29.21,19.81 v33.02,23.62
SCL  (via drill 0.25)
  Top 0.254: MCU.28 45.41,27.54 R5.2 54.65,28.87 v59.69,33.91
  Bottom 0.254: IC2.14 v59.69,33.91
SDA  (via drill 0.25)
  Top 0.254: MCU.27 46.46,26.74 R6.2 54.83,27.01 v60.45,32.64
  Bottom 0.254: IC2.15 v60.45,32.64
TO_BUZZER
  Bottom 0.254: IC1.14 81.66,29.34 81.03,28.7 81.03,17.27 86.87,11.43 D2.A 93.97,12.7 SG1.-
TO_DN
  Bottom 0.406: IC1.16 83.95,26.8 89.15,21.59 91.52,21.59 SV3.1
TO_UP
  Bottom 0.406: IC1.15 87.84,28.07 SV2.1
TX  (via drill 0.25)
  Top 0.254: MCU.31 40.1,29.94 v39.88,29.72
  Bottom 0.254: FTDI.5 27.02,27.53 29.21,29.72 v39.88,29.72
UP_PANEL  (via drill 0.25)
  Top 0.254: MCU.9 33.52,30.74 v33.02,31.24
  Bottom 0.254: RN2.7 79.36,29.06 78.36,28.07 IC1.2 50.42,28.07 47.24,31.24 v33.02,31.24
VD
  Top 0.254: LCD.V0 24.9,44.96 59.94,44.96 VR1.2
XTAL1
  Top 0.254: Q1.1 37.4,34.35 36.58,33.53 36.58,32.22 MCU.7
XTAL2
  Top 0.254: Q1.3 34.99,34.35 35.81,33.53 MCU.8

### Text on the board
tSilk: +5V | U/P | JP1 : / 1&2=19v / 2&3=12v | D/P | 1 | 3 | Start | Mode | Reset | 1
bSilk: UV Box v2 Rev:C / 2016/07/21